# Altium schematic sheet v1.0.SchDoc
size 177 x 50 mm
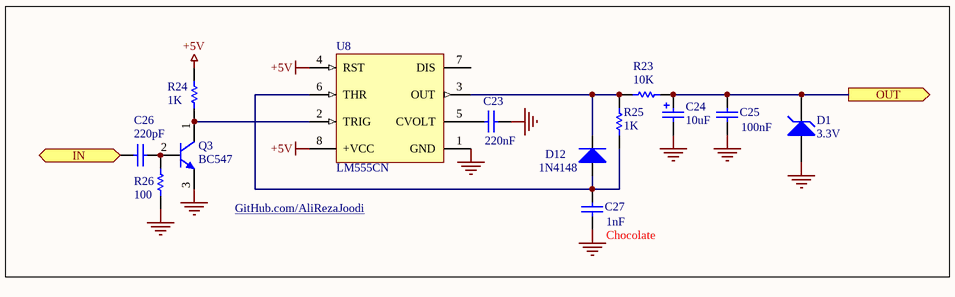
[diagram p0: v1.0.SchDoc]

## Parts
C23  value 220nF  [CAPNTO5.08-7.37x3.94]  (hidden comment: Cap)
C24  value 10uF  [CAPPR2.5-5x6]  (hidden comment: Cap Pol1)
C25  value 100nF  [CAPNTO2.54-3.05x1.78A]  (hidden comment: Cap)
C26  value 220pF  [CAPNTO2.54-3.56x2.03]  (hidden comment: Cap)
C27  value 1nF  [CAPNTO2.54-3.56x2.03]  (hidden comment: Cap)
D1  value 3.3V  [DIODE0.4_Glass]  (hidden comment: Zener Diode)
D12  value 1N4148  [DIODE0.4_Glass]  (hidden comment: Diode)
Q3  value BC547  [TO92C]  (hidden comment: Q3)
R23  value 10K  [AXIAL-0.4]  (hidden comment: Res1)
R24  value 1K  [AXIAL-0.4]  (hidden comment: Res1)
R25  value 1K  [AXIAL-0.4]  (hidden comment: Res1)
R26  value 100  [AXIAL-0.4]  (hidden comment: Res1)
U8  LM555CN  [DIP-8]

## Ports
IN (in), OUT (out)

## Nets
+5V: R24.1 U8.4(RST) U8.8(+VCC)
GND: C23.1 C24.2 C25.2 C27.2 D1.1(A) Q3.3(E) R26.2 U8.1(GND)
IN: C26.2 ; port IN
OUT: C24.1 C25.1 D1.2(K) R23.2 ; port OUT
NetC23_2: C23.2 U8.5(CVOLT)
NetC26_1: C26.1 Q3.2(B) R26.1
NetC27_1: C27.1 D12.1(A) R25.1 U8.6(THR)
NetD12_2: D12.2(K) R23.1 R25.2 U8.3(OUT)
NetQ3_1: Q3.1(C) R24.2 U8.2(TRIG)

Not connected (* = marked no-connect by the designer): U8 7(DIS)

## Notes on the sheet
- GitHub.com/AliRezaJoodi
- (near C27) Chocolate

## Library data of the parts
C23 C25-C27 = Cap: Capacitor; Published: 8-Jun-2000; LatestRevisionDate: 17-Jul-2002; LatestRevisionNote: Re-released for DXP Platform.; PackageReference: RAD-0.3; Publisher: Altium Limited
C24 = Cap Pol1: Polarized Capacitor (Radial); Manufacturer: Generic Components; Class I: Passive; Published: 8-Jun-2000; Revision: July-2002: Re-released for DXP Platform.; Publisher: Altium Limited; Class II: Capacitor
D1 = D Zener: Manufacturer: Generic Components; Class I: Discrete; Class II: Diode - Zener; Published: 8-Jun-2000; Revision: July-2002: Re-released for DXP Platform.; Publisher: Altium Limited
D12 = Diode: Default Diode; Manufacturer: Generic Components; Class I: Discrete; Class II: Diode - Switching; Published: 8-Jun-2000; Revision: July-2002: Re-released for DXP Platform.; Publisher: Altium Limited
Q3 = NPN: NPN Bipolar Transistor; Manufacturer: Generic Components; Class I: Discrete; Class II: BJT - Low Power; Published: 8-Jun-2000; Revision: July-2002: Re-released for DXP Platform.; Publisher: Altium Limited
R23-R26 = Res1: Resistor; Published: 8-Jun-2000; LatestRevisionDate: 17-Jul-2002; LatestRevisionNote: Re-released for DXP Platform.; PackageReference: AXIAL-0.3; Publisher: Altium Limited
U8 = LM555CN: Timer; Manufacturer: National Semiconductor; CompType: Analog IC; PackageTopMarking: NSUZXYTT*LM*555CN; PowerWise: N; Published: 4-Dec-2008; DatasheetVersion: Jul-2006; PackageVersion: revG, May-2006; PackageReference: N08E; Publisher: Altium Limited; PackageDescription: MDIP, .365 x .250 x .130in, 8 Lead, .100in Pitch; PartNumber: LM555CN; PinCount: 8; DigiKeyPartNumber: LM555CNNS-ND; Code_JEDEC: MS-001-BA; ComponentLink1Description: LM555 Datasheet; ComponentLink1URL: http://www.national.com/ds.cgi/LM/LM555.pdf; ComponentLink2Description: LM555 Web Page; ComponentLink2URL: http://www.national.com/pf/LM/LM555.html; ComponentLink3Description: N08E package page; ComponentLink3URL: http://www.national.com/packaging/folders/n08e.html